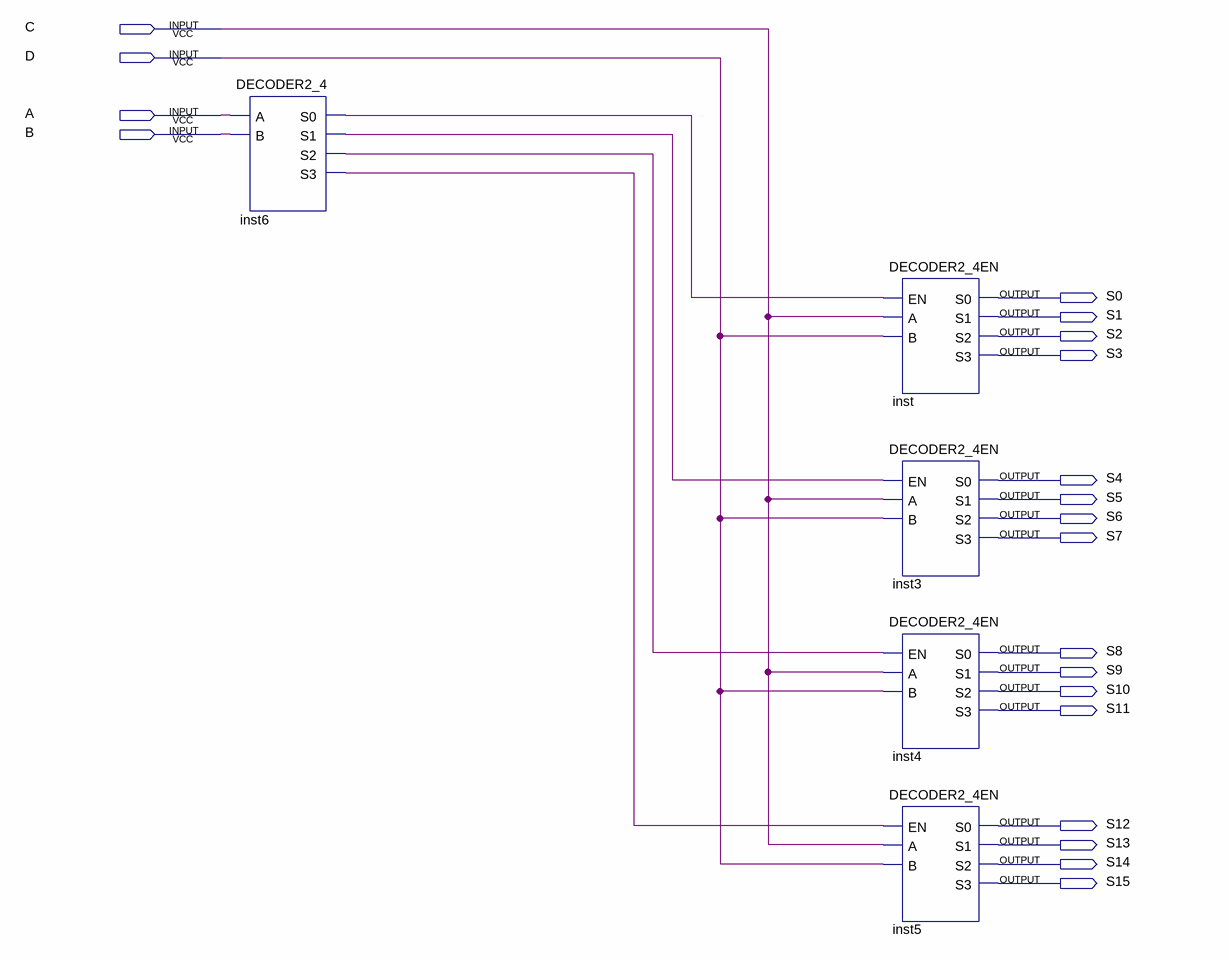
[diagram p0: schematic sheet]
// Quartus schematic DECODER4_16.bdf as structural Verilog: 5 symbols, 20 pins
module DECODER4_16 (
  input  C,
  input  D,
  input  A,
  input  B,
  output S0,
  output S1,
  output S2,
  output S3,
  output S4,
  output S5,
  output S6,
  output S7,
  output S8,
  output S9,
  output S10,
  output S11,
  output S12,
  output S13,
  output S14,
  output S15
);

  wire inst6_s0, inst6_s1, inst6_s2, inst6_s3;

  DECODER2_4 inst6 (.A(A), .B(B), .S0(inst6_s0), .S1(inst6_s1), .S2(inst6_s2), .S3(inst6_s3));
  DECODER2_4EN inst (.EN(inst6_s0), .A(C), .B(D), .S0(S0), .S1(S1), .S2(S2), .S3(S3));
  DECODER2_4EN inst3 (.EN(inst6_s1), .A(C), .B(D), .S0(S4), .S1(S5), .S2(S6), .S3(S7));
  DECODER2_4EN inst4 (.EN(inst6_s2), .A(C), .B(D), .S0(S8), .S1(S9), .S2(S10), .S3(S11));
  DECODER2_4EN inst5 (.EN(inst6_s3), .A(C), .B(D), .S0(S12), .S1(S13), .S2(S14), .S3(S15));
endmodule
